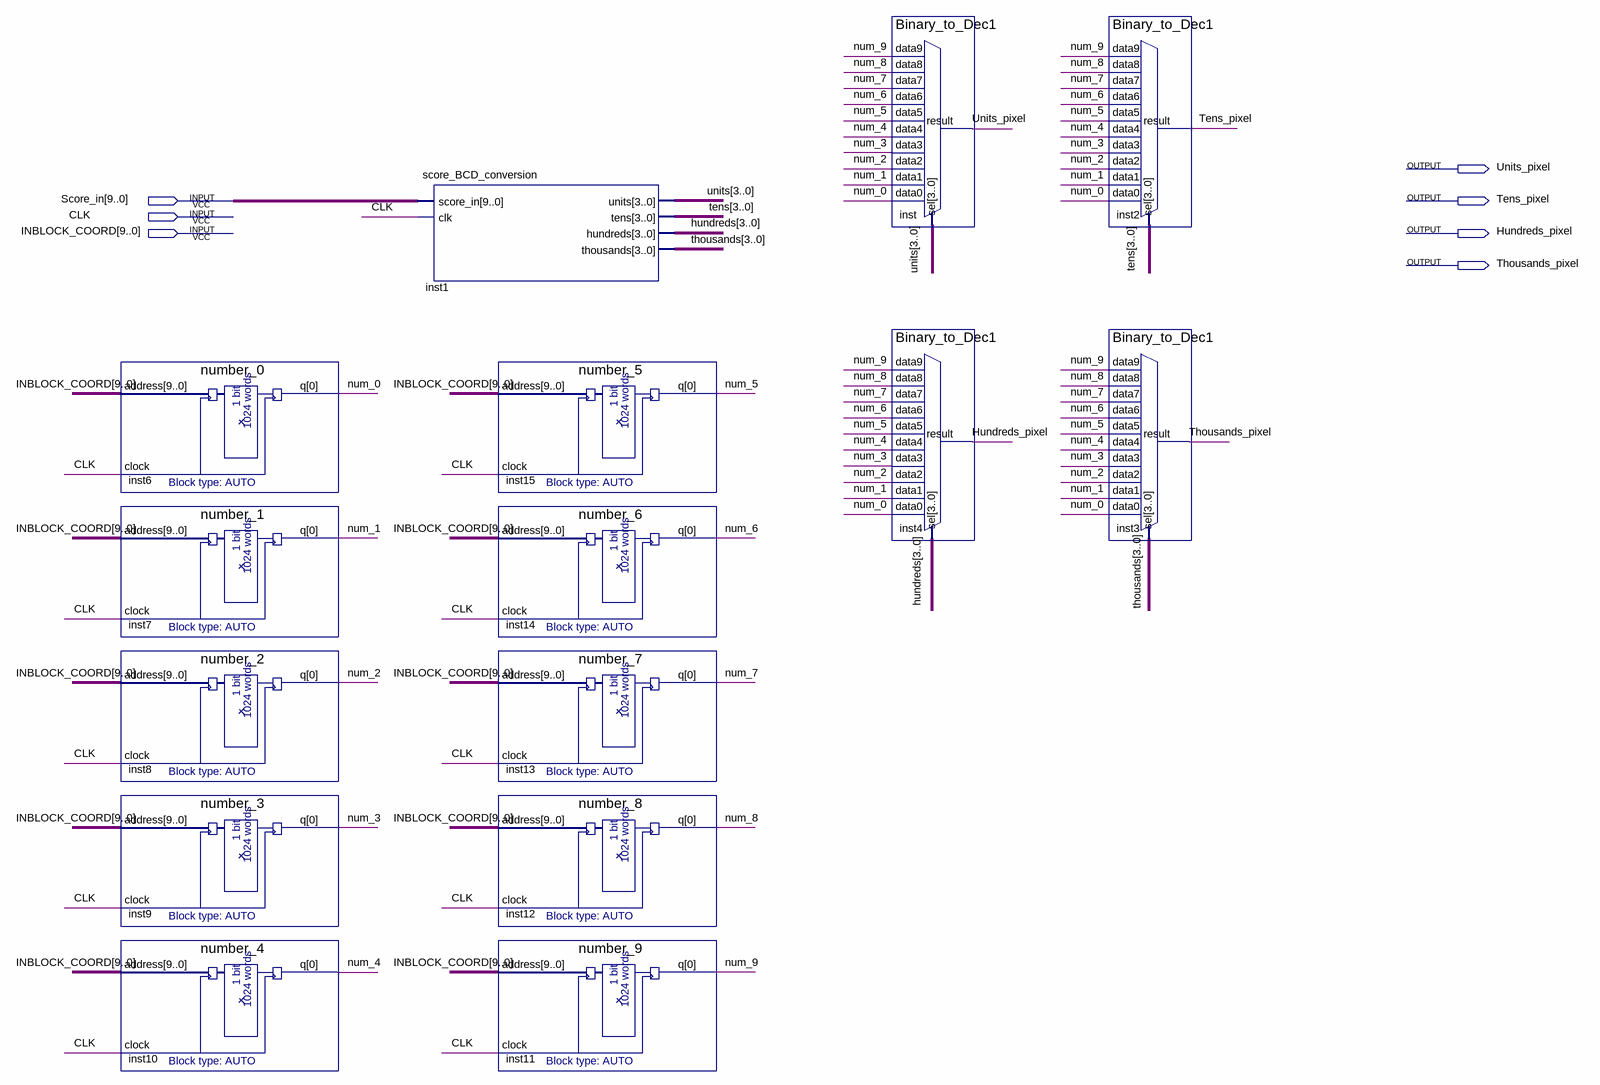
[diagram p0: schematic sheet]
// Quartus schematic score_to_decimal.bdf as structural Verilog: 15 symbols, 7 pins
module score_to_decimal (
  input  [9:0] Score_in,
  input  CLK,
  input  [9:0] INBLOCK_COORD,
  output Units_pixel,
  output Tens_pixel,
  output Hundreds_pixel,
  output Thousands_pixel
);

  wire num_0, num_1, num_2, num_3, num_4, num_5, num_6, num_7, num_8, num_9;
  wire [3:0] hundreds, tens, thousands, units;

  number_0 inst6 (.address(INBLOCK_COORD), .clock(CLK), .q(num_0));
  number_1 inst7 (.address(INBLOCK_COORD), .clock(CLK), .q(num_1));
  number_2 inst8 (.address(INBLOCK_COORD), .clock(CLK), .q(num_2));
  number_3 inst9 (.address(INBLOCK_COORD), .clock(CLK), .q(num_3));
  number_4 inst10 (.address(INBLOCK_COORD), .clock(CLK), .q(num_4));
  score_BCD_conversion inst1 (
    .score_in(Score_in), .clk(CLK), .units(units), .tens(tens), .hundreds(hundreds), .thousands(thousands));
  number_5 inst15 (.address(INBLOCK_COORD), .clock(CLK), .q(num_5));
  number_6 inst14 (.address(INBLOCK_COORD), .clock(CLK), .q(num_6));
  number_7 inst13 (.address(INBLOCK_COORD), .clock(CLK), .q(num_7));
  number_8 inst12 (.address(INBLOCK_COORD), .clock(CLK), .q(num_8));
  number_9 inst11 (.address(INBLOCK_COORD), .clock(CLK), .q(num_9));
  Binary_to_Dec1 inst (
    .data9(num_9), .data8(num_8), .data7(num_7), .data6(num_6), .data5(num_5), .data4(num_4), .data3(num_3),
    .data2(num_2), .data1(num_1), .data0(num_0), .sel(units), .result(Units_pixel));
  Binary_to_Dec1 inst4 (
    .data9(num_9), .data8(num_8), .data7(num_7), .data6(num_6), .data5(num_5), .data4(num_4), .data3(num_3),
    .data2(num_2), .data1(num_1), .data0(num_0), .sel(hundreds), .result(Hundreds_pixel));
  Binary_to_Dec1 inst2 (
    .data9(num_9), .data8(num_8), .data7(num_7), .data6(num_6), .data5(num_5), .data4(num_4), .data3(num_3),
    .data2(num_2), .data1(num_1), .data0(num_0), .sel(tens), .result(Tens_pixel));
  Binary_to_Dec1 inst3 (
    .data9(num_9), .data8(num_8), .data7(num_7), .data6(num_6), .data5(num_5), .data4(num_4), .data3(num_3),
    .data2(num_2), .data1(num_1), .data0(num_0), .sel(thousands), .result(Thousands_pixel));
endmodule
